# EAGLE design lilypad_V2 (EAGLE 9.6.2)
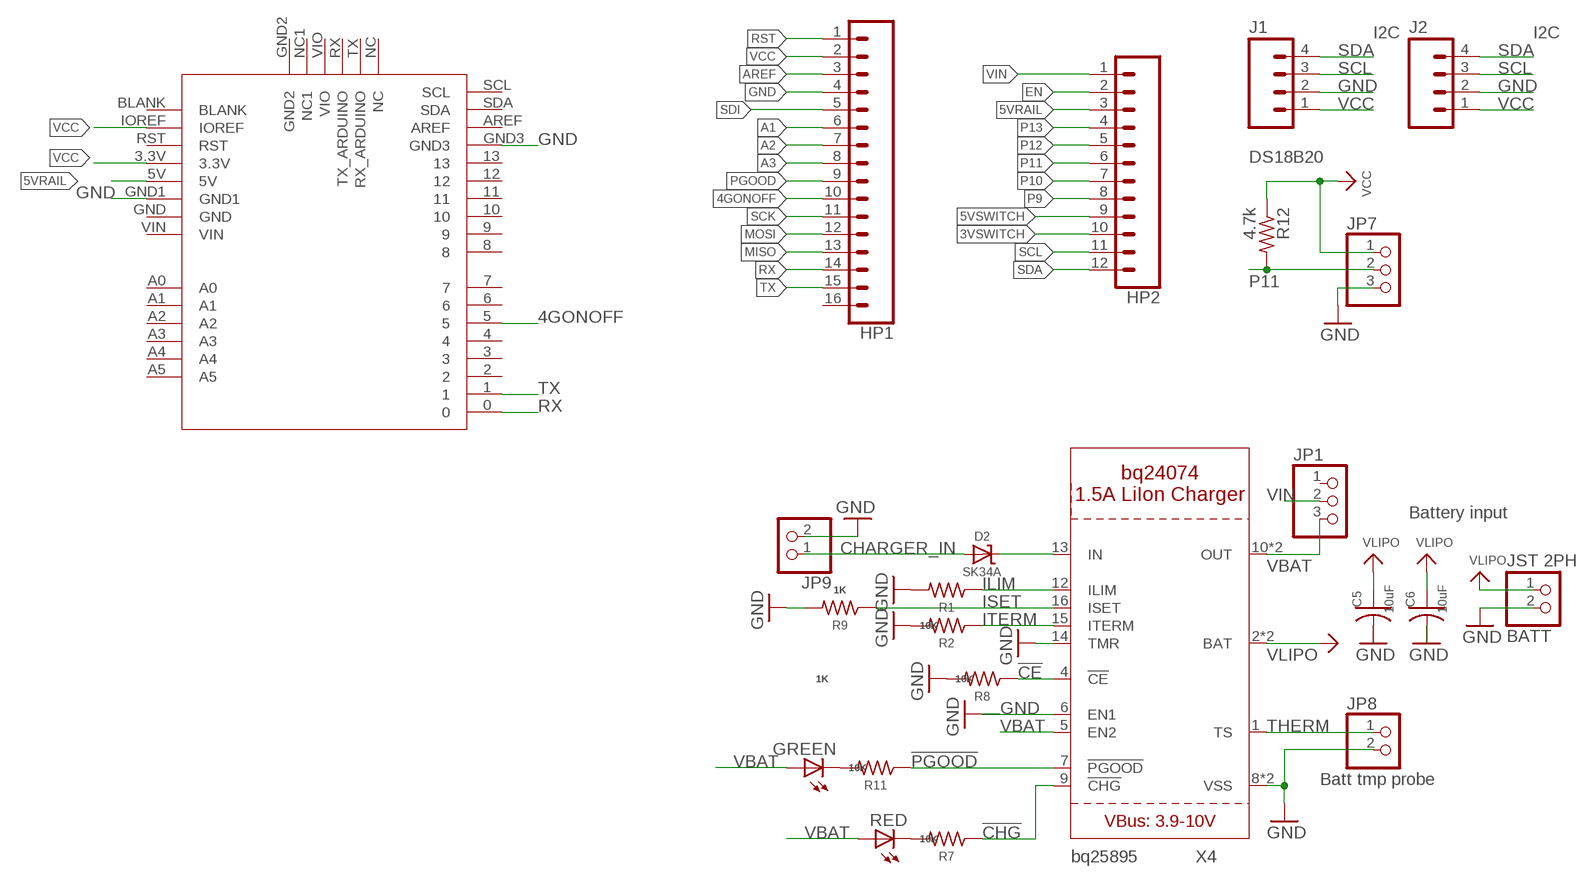
[diagram p0: schematic, sheet 1]

## Parts
BATT  JST 2PH  JST_2PIN-SMT-RA  [JST-PH-2-SMT-RA]
C5  10uF  C-USC0805K  [C0805K]
C6  10uF  C-USC0805K  [C0805K]
D2  SK34A  DIODE-SCHOTTKYSMA  [SMADIODE]
GREEN  LEDSMT1206  [1206]
HP1  CONN_16  [1X16]
HP2  CONN_12  [1X12]
J1  M04PTH  [1X04]
J2  M04PTH  [1X04]
JP1  PINHD-1X3  [1X03]
JP7  PINHD-1X3  [1X03]
JP8  PINHD-1X2  [1X02]
JP9  PINHD-1X2  [1X02]
R1  1K  R-US_M0805  [M0805]
R2  10K  R-US_M0805  [M0805]
R7  10K  R-US_M0805  [M0805]
R8  10K  R-US_M0805  [M0805]
R9  1K  R-US_M0805  [M0805]
R11  10K  R-US_M0805  [M0805]
R12  4.7k  FLIPFLOP-RES  [0805-THM]
RED  LEDSMT1206  [1206]
U$2  LTE_BOARD  [LTE_BOARD_FOOTPRINT]
X4  BQ24074  [QFN16_3MM]

## Nets
3VSWITCH: HP2.10
4GONOFF: HP1.10 U$2.5
5VRAIL: HP2.3 U$2.5V
5VSWITCH: HP2.9
!CE: R8.1 X4.4(!CE)
!CHG: R7.1 X4.9(!CHG)
!PGOOD: R11.1 X4.7(!PGOOD)
A1: HP1.6
A2: HP1.7
A3: HP1.8
AREF: HP1.3
CHARGER_IN: D2.A JP9.1
EN: HP2.2
GND: BATT.2 C5.2 C6.2 HP1.4 J1.2 J2.2 JP7.3 JP8.2 JP9.2 R1.2 R2.2 R8.2 R9.2 U$2.GND1 U$2.GND3 X4.6(EN1) X4.8(VSS) X4.14(TMR) X4.THERMAL(VSS)
ILIM: R1.1 X4.12(ILIM)
ISET: R9.1 X4.16(ISET)
ITERM: R2.1 X4.15(ITERM)
MISO: HP1.13
MOSI: HP1.12
N$1: GREEN.C R11.2
N$2: D2.C X4.13(IN)
N$3: R7.2 RED.C
P9: HP2.8
P10: HP2.7
P11: HP2.6 JP7.2 R12.2
P12: HP2.5
P13: HP2.4
PGOOD: HP1.9
RST: HP1.1
RX: HP1.14 U$2.0
SCK: HP1.11
SCL: HP2.11 J1.3 J2.3
SDA: HP2.12 J1.4 J2.4
SDI: HP1.5
THERM: JP8.1 X4.1(TS)
TX: HP1.15 U$2.1
VBAT: GREEN.A JP1.3 RED.A X4.5(EN2) X4.10(OUT) X4.11(OUT)
VCC: HP1.2 J1.1 J2.1 JP7.1 R12.1 U$2.3.3V U$2.IOREF
VIN: HP2.1 JP1.2
VLIPO: BATT.1 C5.1 C6.1 X4.2(BAT) X4.3(BAT)
Unconnected: HP1.16 JP1.1 U$2.2 U$2.3 U$2.4 U$2.6 U$2.7 U$2.8 U$2.9 U$2.10 U$2.11 U$2.12 U$2.13 U$2.A0 U$2.A1 U$2.A2 U$2.A3 U$2.A4 U$2.A5 U$2.AREF U$2.BLANK U$2.GND U$2.GND2 U$2.NC U$2.NC1 U$2.RST U$2.RX(TX_ARDUINO) U$2.SCL U$2.SDA U$2.TX(RX_ARDUINO) U$2.VIN U$2.VIO

## Notes on the sheet
- I2C | I2C
- DS18B20
- Battery input
- Batt tmp probe

## Library data of the parts
BATT = adafruit:JST_2PIN: JST 2-Pin Connectors of various flavors SMT-RA (S2B-PH-SM4) 4UConnector #17311 SMT (B2B-PH-SM4) THM-RA (S2B-PH) THM (B2B-PH)
C5 C6 = adafruit:C-US: CAPACITOR, American symbol
D2 = microbuilder:DIODE-SCHOTTKY
GREEN RED = adafruit:LED: LED OSRAM: - CHIPLED LG R971, LG N971, LY N971, LG Q971, LY Q971, LO R971, LY R971 LH N974, LH R974 LS Q976, LO Q976, LY Q976 LO Q996 - Hyper CHIPLED LW Q18S LB Q993, LB Q99A, LB R99A - SideLED LS A670, LO A670, LY A670, LG A670, LP A670 LB A673, LV A673, LT A673, LW A673 LH A674 LY A675 LS A676, LA A676, LO A676, LY A676, LW A676 LS A679, LY A679, LG A679 - Hyper Micro SIDELED® LS Y876, LA Y876, LO Y876, LY Y876 LT Y87S - SmartLED LW L88C, LW L88S LB L89C, LB L89S, LG L890 LS L89K, LO L89K, LY L89K LS L896, LA L896, LO L896, LY L896 - TOPLED LS T670, LO T670, LY T670, LG T670, LP T670 LSG T670, LSP T670, LSY T670, LOP T670, LYG T670 LG T671, LOG T671, LSG T671 LB T673, LV T673, LT T673, LW T673 LH T674 LS T676, LA T676, LO T676, LY T676, LB T676, LH T676, LSB T676, LW T676 LB T67C, LV T67C, LT T67C, LS T67K, LO T67K, LY T67K, LW E67C LS E67B, LA E67B, LO E67B, LY E67B, LB E67C, LV E67C, LT E67C LW T67C LS T679, LY T679, LG T679 LS T770, LO T770, LY T770, LG T770, LP T770 LB T773, LV T773, LT T773, LW T773 LH T774 LS E675, LA E675, LY E675, LS T675 LS T776, LA T776, LO T776, LY T776, LB T776 LHGB T686 LT T68C, LB T68C - Hyper Mini TOPLED® LB M676 - Mini TOPLED Santana® LG M470 LS M47K, LO M47K, LY M47K Source: http://www.osram.convergy.de/
HP1 = SparkFun-Connectors:CONN_16: Multi connection point. Often used as Generic Header-pin footprint for 0.1 inch spaced/style header connections On any of the 0.1 inch spaced packages, you can populate with these: Break Away Headers - Straight <https://www.sparkfun.com/products/116> (PRT-00116) Break Away Male Headers - Right Angle <https://www.sparkfun.com/products/553> (PRT-00553) Female Headers <https://www.sparkfun.com/products/115> (PRT-00115) Break Away Headers - Machine Pin <https://www.sparkfun.com/products/117> (PRT-00117) Break Away Female Headers - Swiss Machine Pin <https://www.sparkfun.com/products/743> (PRT-00743) For SCREWTERMINALS and SPRING TERMINALS visit here: Screw Terimnals on SparkFun.com <https://www.sparkfun.com/search/results?term=Screw+Terminals> (5mm/3.5mm/2.54mm spacing) This device is also useful as a general connection point to wire up your design to another part of your project. Our various solder wires solder well into these plated through hole pads. Hook-Up Wire - Assortment (Stranded, 22 AWG) <https://www.sparkfun.com/products/11375> (PRT-11375) Hook-Up Wire - Assortment (Solid Core, 22 AWG) <https://www.sparkfun.com/products/11367> (PRT-11367) View the entire wire category on our website here <https://www.sparkfun.com/categories/141> Special notes: Molex polarized connector foot print use with SKU : PRT-08231 with associated crimp pins and housings. 1MM SMD Version SKU: PRT-10208 NOTES ON THE VARIANTS LOCK and LOCK_LONGPADS... This footprint was designed to help hold the alignment of a through-hole component (i.e. 6-pin header) while soldering it into place. You may notice that each hole has been shifted either up or down by 0.005 of an inch from it's more standard position (which is a perfectly straight line). This slight alteration caused the pins (the squares in the middle) to touch the edges of the holes. Because they are alternating, it causes a "brace" to hold the component in place. 0.005 has proven to be the perfect amount of "off-center" position when using our standard breakaway headers. Although looks a little odd when you look at the bare footprint, once you have a header in there, the alteration is very hard to notice. Also,if you push a header all the way into place, it is covered up entirely on the bottom side.
HP2 = SparkFun-Connectors:CONN_12: Multi connection point. Often used as Generic Header-pin footprint for 0.1 inch spaced/style header connections On any of the 0.1 inch spaced packages, you can populate with these: Break Away Headers - Straight <https://www.sparkfun.com/products/116> (PRT-00116) Break Away Male Headers - Right Angle <https://www.sparkfun.com/products/553> (PRT-00553) Female Headers <https://www.sparkfun.com/products/115> (PRT-00115) Break Away Headers - Machine Pin <https://www.sparkfun.com/products/117> (PRT-00117) Break Away Female Headers - Swiss Machine Pin <https://www.sparkfun.com/products/743> (PRT-00743) For SCREWTERMINALS and SPRING TERMINALS visit here: Screw Terimnals on SparkFun.com <https://www.sparkfun.com/search/results?term=Screw+Terminals> (5mm/3.5mm/2.54mm spacing) This device is also useful as a general connection point to wire up your design to another part of your project. Our various solder wires solder well into these plated through hole pads. Hook-Up Wire - Assortment (Stranded, 22 AWG) <https://www.sparkfun.com/products/11375> (PRT-11375) Hook-Up Wire - Assortment (Solid Core, 22 AWG) <https://www.sparkfun.com/products/11367> (PRT-11367) View the entire wire category on our website here <https://www.sparkfun.com/categories/141> Special notes: Molex polarized connector foot print use with SKU : PRT-08231 with associated crimp pins and housings. 1MM SMD Version SKU: PRT-10208 NOTES ON THE VARIANTS LOCK and LOCK_LONGPADS... This footprint was designed to help hold the alignment of a through-hole component (i.e. 6-pin header) while soldering it into place. You may notice that each hole has been shifted either up or down by 0.005 of an inch from it's more standard position (which is a perfectly straight line). This slight alteration caused the pins (the squares in the middle) to touch the edges of the holes. Because they are alternating, it causes a "brace" to hold the component in place. 0.005 has proven to be the perfect amount of "off-center" position when using our standard breakaway headers. Although looks a little odd when you look at the bare footprint, once you have a header in there, the alteration is very hard to notice. Also,if you push a header all the way into place, it is covered up entirely on the bottom side.
J1 J2 = SparkFun-Connectors:M04: Header 4 Standard 4-pin 0.1" header. Use with straight break away headers (SKU : PRT-00116), right angle break away headers (PRT-00553), swiss pins (PRT-00743), machine pins (PRT-00117), and female headers (PRT-00115). Molex polarized connector foot print use with SKU : PRT-08231 with associated crimp pins and housings. 1MM SMD Version SKU: PRT-10208; PROD_ID: CONN-09696
JP1 JP7 = adafruit:PINHD-1X3: PIN HEADER
JP8 JP9 = pinhead:PINHD-1X2: PIN HEADER
R1 R2 R7-R9 R11 = adafruit:R-US_: RESISTOR, American symbol
R12 = adafruit:FLIPFLOP-RES: Flip Flop resistor An 0805 resistor inside a standard 1/4W 5% resistor. Makes for easy mods
U$2 = LTE_BOARD:LTE_BOARD: LTE_BOARD
X4 = adafruit_power:BQ24074

## Board
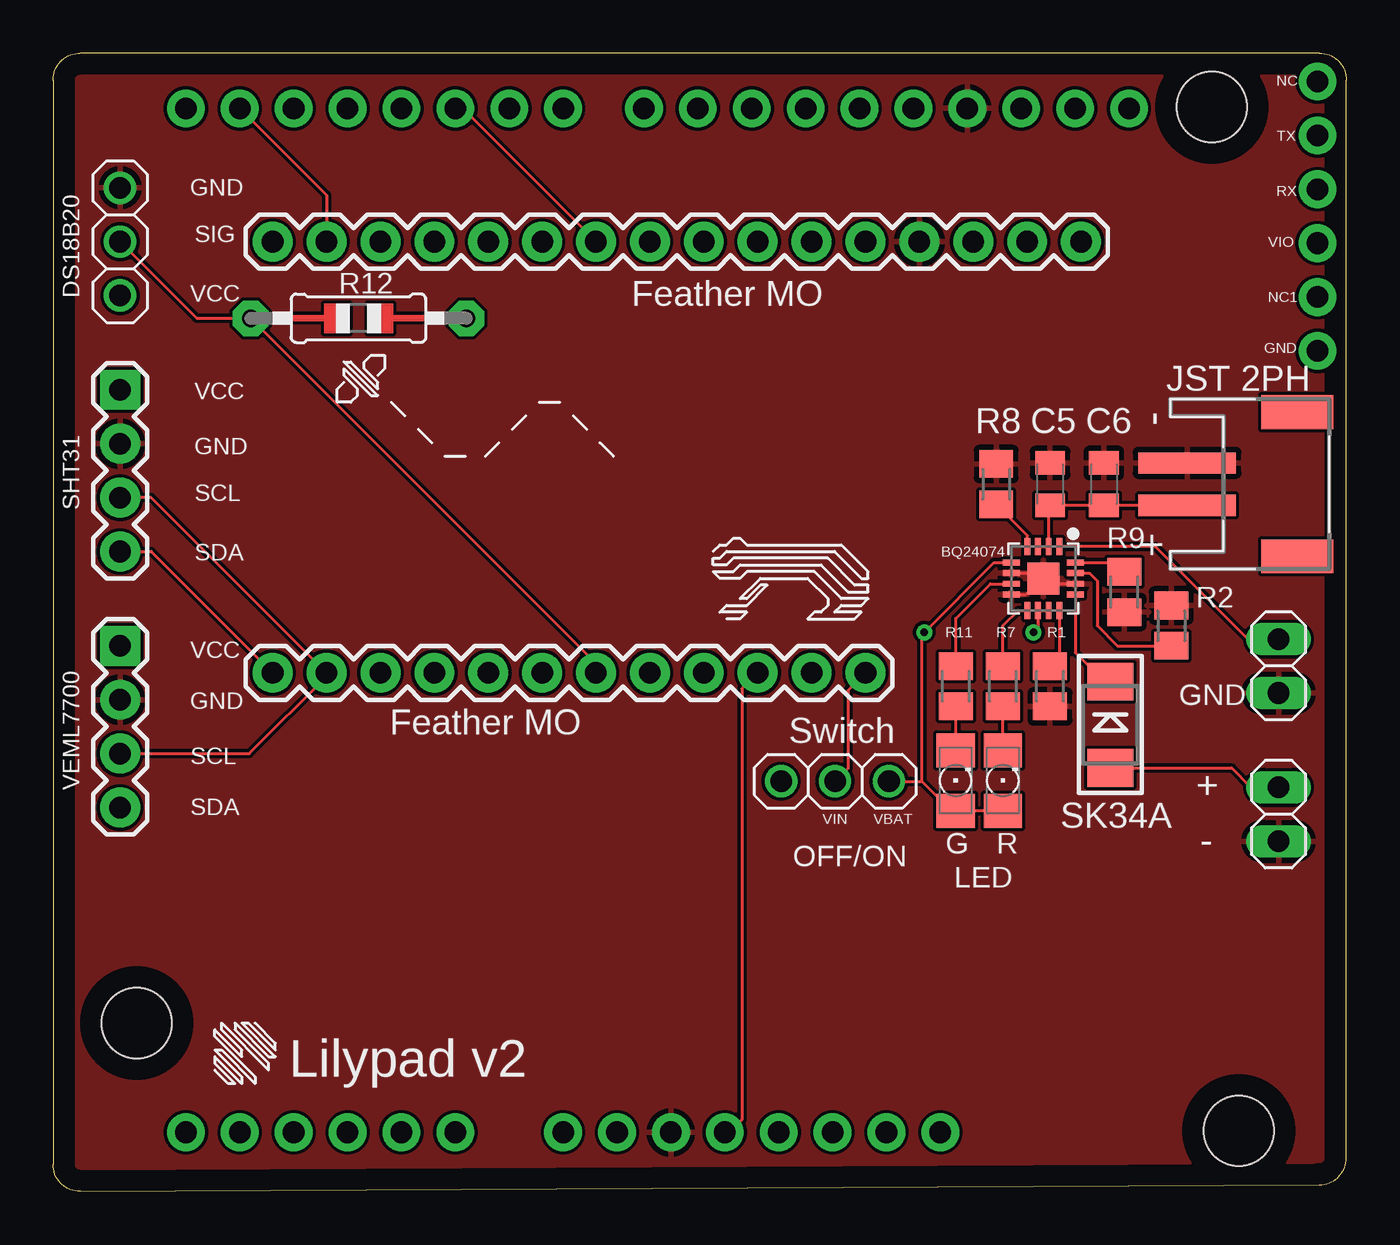
[diagram p1: board, top side]
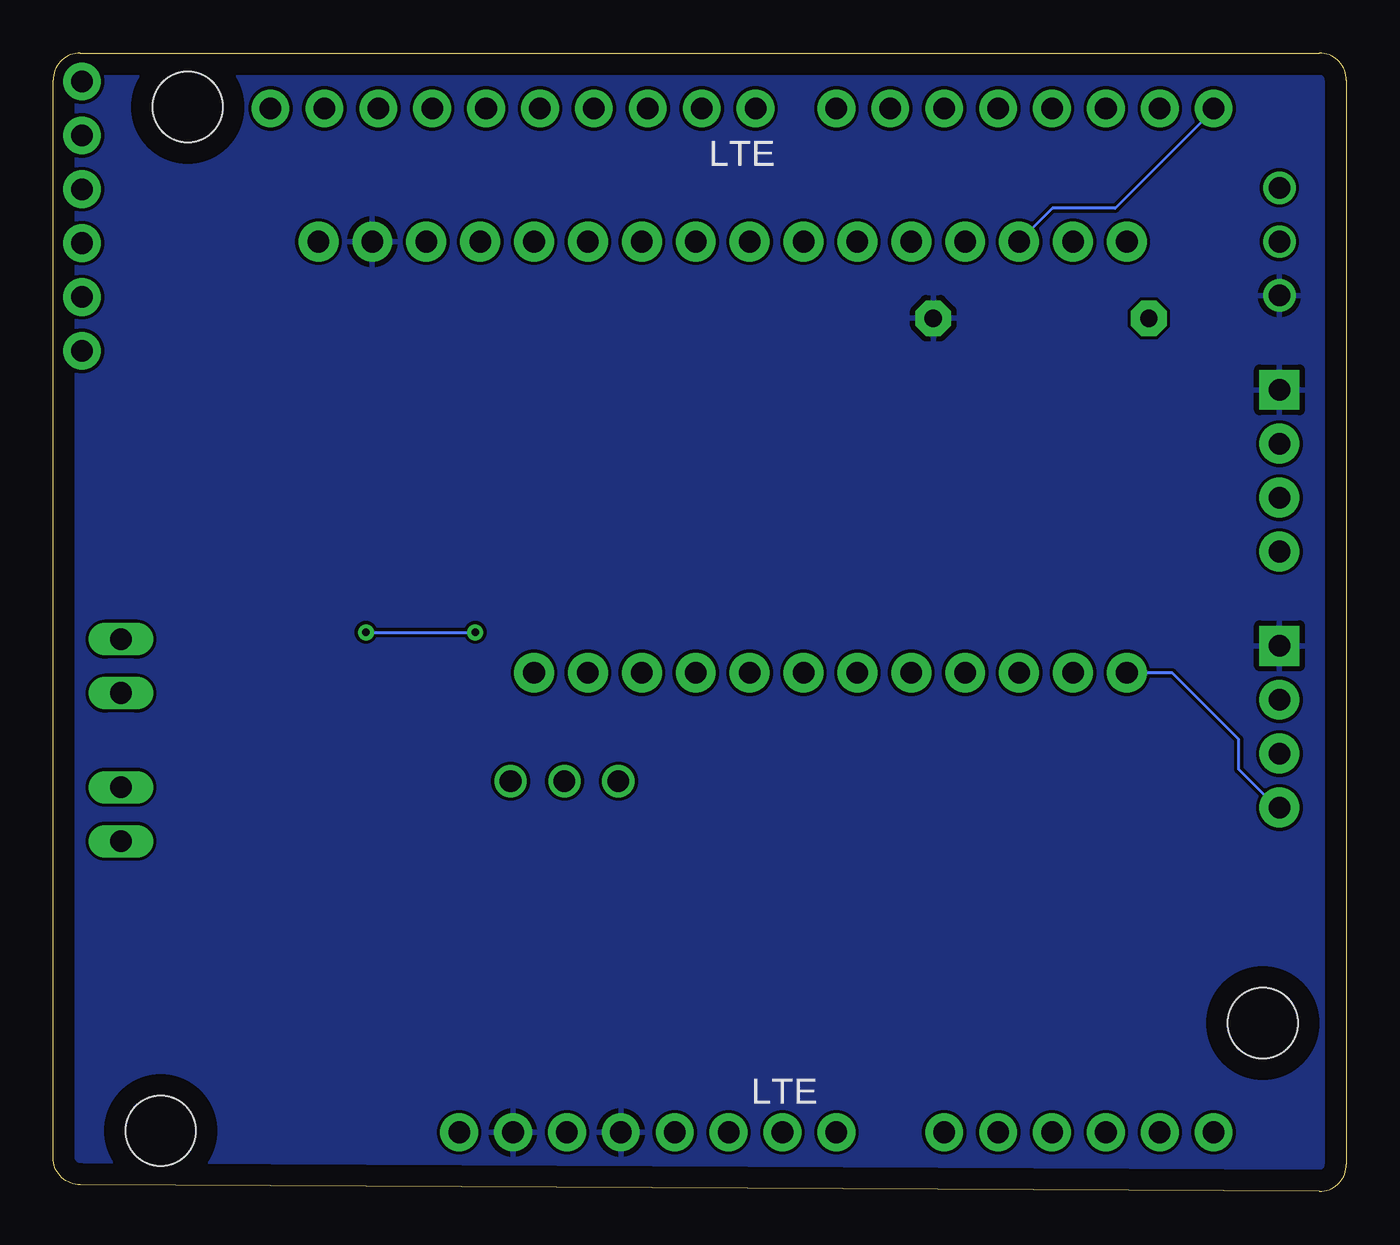
[diagram p2: board, bottom side, seen from below]

Size 60.96 x 53.66 mm. Coordinates in mm from the lower left corner, seen from the top.
Outline: 1.27,0 59.69,0.32 arc90 60.96,1.59 60.96,52.39 arc90 59.69,53.66 1.27,53.66 arc90 0,52.39 0,1.27 arc90 1.27,0
Copper layers (1*16): Top 0.035mm / dielectric 1.5mm / Bottom 0.035mm
Design rules "default": minimum track width 6mil, minimum drill 0.35mm, track to track 6mil, track to pad 6mil, pad to pad 6mil, via to via 6mil, smd to smd 6mil, copper to edge 40mil, drill to drill 6mil, minimum pad ring 10mil, minimum via ring 8mil, stop-mask expansion 4mil, vias tented up to drill 0mil, thermal gap 10mil

### Footprints (pad centres in the part's own frame; a part is rotated, then mirrored left to right if it is on the bottom)
JST-PH-2-SMT-RA = smd 1 x 4.6: 1 1,-3.7; 2 -1,-3.7 | smd 1.6 x 3.4: NC1 -3.4,1.5; NC2 3.4,1.5
C0805K = smd 1.1 x 1.4: 1 -1,0; 2 1,0
SMADIODE = smd 1.778 x 2.159: A 2.019,0; C -2.045,0
1206 = smd 1.6 x 1.803: A -1.422,0; C 1.422,0
STAND-OFF = hole 3.302: 0,0
1X16 = drill 1.016 pad 1.88: 1 0,0; 2 2.54,0; 3 5.08,0; 4 7.62,0; 5 10.16,0; 6 12.7,0; 7 15.24,0; 8 17.78,0; 9 20.32,0; 10 22.86,0; 11 25.4,0; 12 27.94,0; 13 30.48,0; 14 33.02,0; 15 35.56,0; 16 38.1,0
1X12 = drill 1.016 pad 1.88: 1 0,0; 2 2.54,0; 3 5.08,0; 4 7.62,0; 5 10.16,0; 6 12.7,0; 7 15.24,0; 8 17.78,0; 9 20.32,0; 10 22.86,0; 11 25.4,0; 12 27.94,0
1X04 = drill 1.016 pad 1.88 square: 1 0,0 | drill 1.016 pad 1.88: 2 2.54,0; 3 5.08,0; 4 7.62,0
1X03 = drill 1.016: 1 -2.54,0; 2 0,0; 3 2.54,0
1X02 = drill 1.016 long: 1 -1.27,0; 2 1.27,0
M0805 = smd 1.3 x 1.6: 1 -0.95,0; 2 0.95,0
0805-THM = drill 0.813 pad 1.676 octagon: 1 -5.08,0; 2 5.08,0
LTE_BOARD_FOOTPRINT = drill 1.016 pad 1.778: 0 35.56,48.26; 1 33.02,48.26; 2 30.48,48.26; 3 27.94,48.26; 3.3V 7.62,0; 4 25.4,48.26; 5 22.86,48.26; 5V 10.16,0; 6 20.32,48.26; 7 17.78,48.26; 8 13.97,48.26; 9 11.43,48.26; 10 8.89,48.26; 11 6.35,48.26; 12 3.81,48.26; 13 1.27,48.26; A0 22.86,0; A1 25.4,0; A2 27.94,0; A3 30.48,0; A4 33.02,0; A5 35.56,0; AREF -3.81,48.26; BLANK 0,0; GND 15.24,0; GND1 12.7,0; GND2 -17.78,36.83; GND3 -1.27,48.26; IOREF 2.54,0; NC -17.78,49.53; NC1 -17.78,39.37; RST 5.08,0; RX -17.78,44.45; SCL -8.89,48.26; SDA -6.35,48.26; TX -17.78,46.99; VIN 17.78,0; VIO -17.78,41.91
QFN16_3MM = smd 0.8 x 0.28: 1 -1.5,0.75; 2 -1.5,0.25; 3 -1.5,-0.25; 4 -1.5,-0.75; 9 1.5,-0.75; 10 1.5,-0.25; 11 1.5,0.25; 12 1.5,0.75 | smd 0.28 x 0.8: 5 -0.75,-1.5; 6 -0.25,-1.5; 7 0.25,-1.5; 8 0.75,-1.5; 13 0.75,1.5; 14 0.25,1.5; 15 -0.25,1.5; 16 -0.75,1.5 | smd 1.5 x 1.5: THERMAL 0,0

### Placement (x,y rotation side)
BATT  57.15,33.34 270 top
C5  46.99,33.34 90 top
C6  49.53,33.34 90 top
D2  49.83,21.98 270 top
GREEN  42.55,19.37 90 top
H1  STAND-OFF  [STAND-OFF]  55.88,2.86 0 top
H2  STAND-OFF  [STAND-OFF]  54.61,51.12 0 top
H3  STAND-OFF  [STAND-OFF]  3.94,7.94 0 top
HP1  48.45,44.77 180 top
HP2  38.29,24.45 180 top
J1  3.16,37.78 270 top
J2  3.16,25.72 270 top
JP1  36.86,19.33 0 top
JP7  3.16,44.77 90 top
JP8  57.76,24.77 270 top
JP9  57.76,17.78 270 top
R1  46.99,23.81 270 top
R2  52.7,26.67 90 top
R7  44.77,23.81 270 top
R8  44.45,33.34 90 top
R9  50.48,28.26 270 top
R11  42.55,23.81 270 top
R12  14.39,41.16 180 top
RED  44.77,19.37 90 top
U$2  41.82,2.79 0 bottom
X4  46.67,28.89 270 top

### Tracks (layer width: path | path; a pad name or v marks a point on that pad's centre or on a via)
4GONOFF
  Top 0.152: U$2.5 19.31,51.05 HP1.10
5VRAIL
  Top 0.152: HP2.3 32.46,23.7 32.46,3.39 31.86,2.79 U$2.5V
!CE
  Top 0.152: X4.4 45.92,30.92 R8.1
!CHG
  Top 0.152: R7.1 44.77,26.67 45.49,27.39 X4.9
!PGOOD
  Top 0.152: X4.7 44.17,28.64 42.55,27.01 R11.1
CHARGER_IN
  Top 0.152: D2.A 55.55,19.96 56.46,19.05 JP9.1
GND
  Top 0.152: X4.6 46.42,29.14 X4.THERMAL | X4.THERMAL 46.6,28.89 45.86,28.15 X4.8 | X4.14 46.92,28.64 X4.THERMAL
  pour Top: -1.59,54.93 62.87,54.93 62.87,-1.59 -1.59,-1.59
ILIM
  Top 0.152: X4.12 47.42,25.2 R1.1
ISET
  Top 0.152: X4.16 50.37,29.64 50.48,29.52 R9.1
ITERM
  Top 0.152: X4.15 48.84,29.14 49.21,28.77 49.21,26.67 50.16,25.72 R2.1
N$1
  Top 0.152: GREEN.C R11.2
N$2
  Top 0.152: X4.13 48.17,25.4 49.55,24.03 D2.C
N$3
  Top 0.152: RED.C R7.2
P11
  Top 0.152: JP7.2 6.74,41.19 6.77,41.16 R12.2 25.59,24.88 HP2.6
RX
  Bottom 0.152: U$2.0 6.26,50.98 10.9,46.34 13.86,46.34 HP1.14
SCL
  Top 0.152: J2.3 9.25,20.64 12.89,24.27 HP2.11 4.63,32.7 J1.3
SDA
  Top 0.152: J1.4 4.63,30.16 HP2.12
  Bottom 0.152: J2.4 3.28,18.1 5.08,19.9 5.08,21.31 8.21,24.45 HP2.12
THERM
  Top 0.152: X4.1 51.95,30.39 56.3,26.04 JP8.1
TX
  Top 0.152: U$2.1 12.89,46.96 HP1.15
VBAT  (via drill 0.35)
  Top 0.152: RED.A GREEN.A 42.34,17.95 40.95,19.33 | X4.11 X4.10 46.42,26.56 v46.21,26.35 | JP1.3 40.95,19.33 | 40.95,19.33 40.95,26.25 v41.06,26.35 44.35,29.64 X4.5
  Bottom 0.152: v46.21,26.35 v41.06,26.35
VCC
  pour Bottom: -2.22,55.56 63.5,55.56 63.5,-2.22 -2.22,-2.22
VIN
  Top 0.152: HP2.1 37.45,23.61 37.45,19.93 JP1.2
VLIPO
  Top 0.152: BATT.1 C6.1 C5.1 46.92,32.27 X4.2 X4.3

### Text on the board
tNames: NC | TX | GND | RX | SIG | VIO | DS18B20 | VCC | R12 | NC1 | Feather MO | GND | VCC | JST 2PH | R8 | C5 | C6 | GND | SHT31 | SCL | BQ24074 | R9 | SDA | R2 | R11 | R7 | R1 | VCC | GND | GND | Feather MO | Switch | SCL | VEML7700 | + | SDA | VIN | VBAT | SK34A | G | R | - | OFF/ON | LED | Lilypad v2
bNames: LTE | LTE